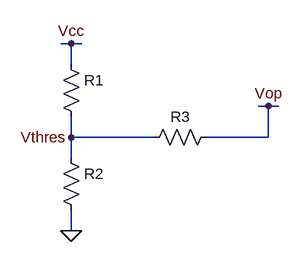
[diagram p0: schematic hysteresis_resistors.asc]
hysteresis_resistors.asc, the LTspice schematic file:
Version 4
SHEET 1 880 680
WIRE 16 48 0 48
WIRE 32 48 16 48
WIRE 16 80 16 48
WIRE 320 144 304 144
WIRE 336 144 320 144
WIRE 16 192 16 160
WIRE 144 192 16 192
WIRE 320 192 320 144
WIRE 320 192 224 192
WIRE 16 224 16 192
WIRE 16 336 16 304
FLAG 320 144 Vop
FLAG 16 192 Vthres
FLAG 16 336 0
FLAG 16 48 Vcc
SYMBOL res 0 64 R0
SYMATTR InstName R1
SYMATTR Value ""
SYMBOL res 0 208 R0
SYMATTR InstName R2
SYMATTR Value ""
SYMBOL res 240 176 R90
WINDOW 0 0 56 VBottom 2
WINDOW 3 32 56 VTop 2
SYMATTR InstName R3
SYMATTR Value ""

The netlist it stands for:
* hysteresis_resistors.asc
R1 Vcc Vthres
R2 Vthres 0
R3 Vop Vthres
.backanno
.end